# Altium schematic sheet mcu.SchDoc
size A4; SheetNumber: 2; SheetTotal: 3
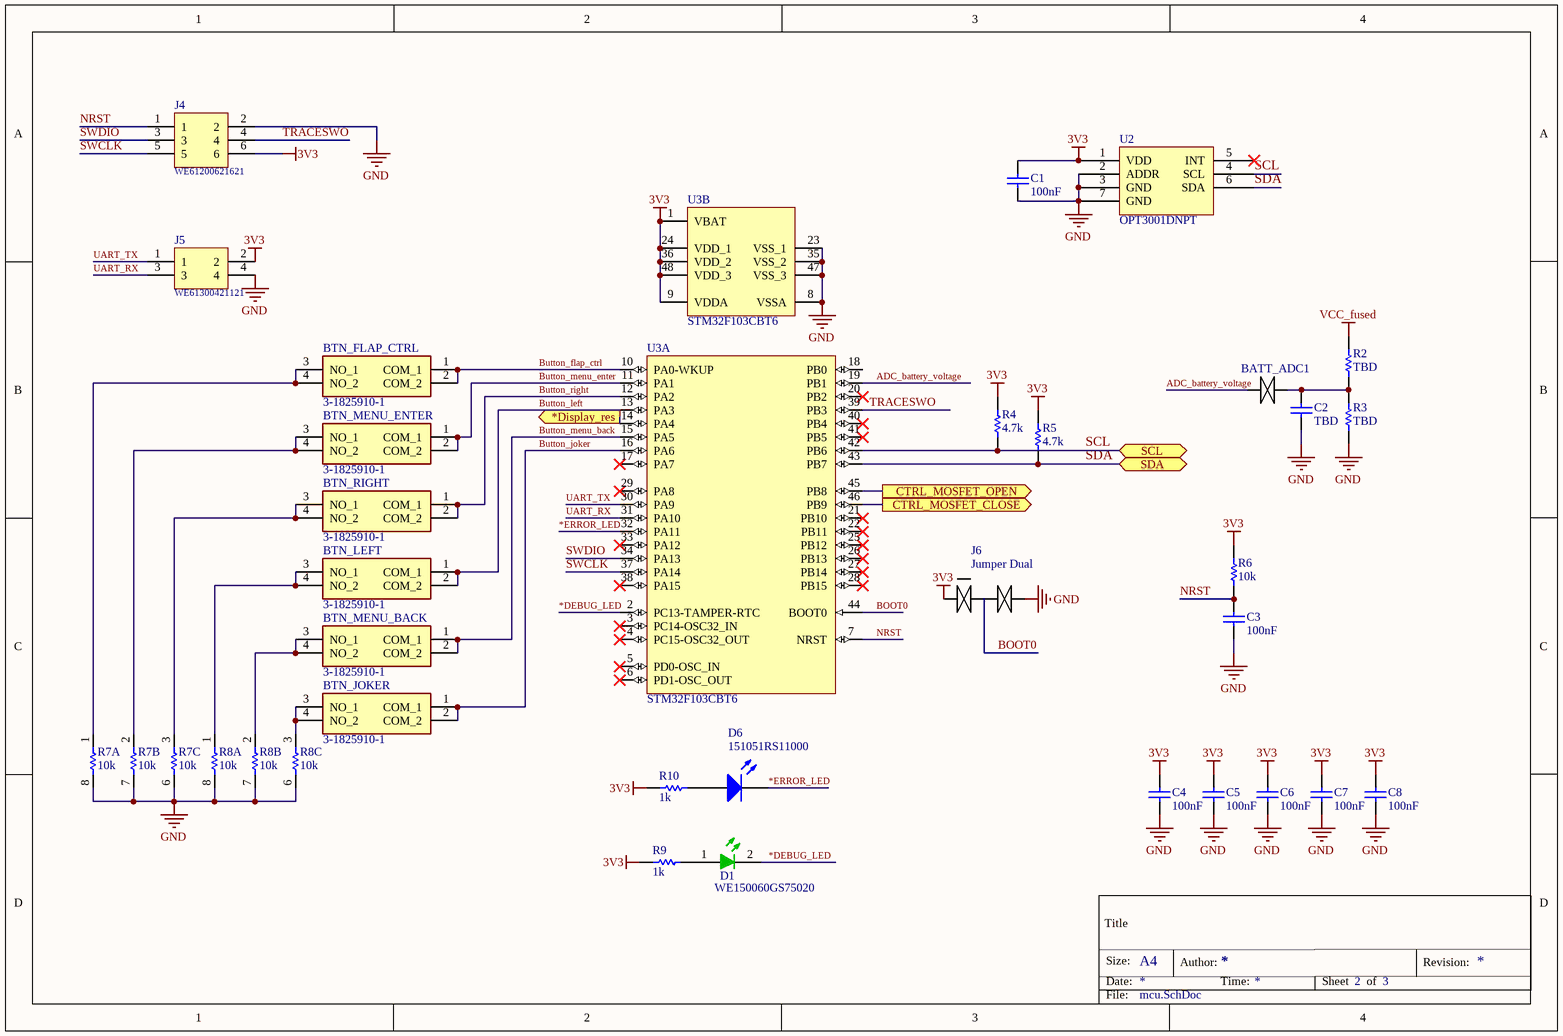
[diagram p0: mcu.SchDoc]

## Parts
BATT_ADC1  TIMER  [JUMPER_SINGLE_SMALL]  (value not drawn)
BTN_FLAP_CTRL  3-1825910-1  [318259101]
BTN_JOKER  3-1825910-1  [318259101]
BTN_LEFT  3-1825910-1  [318259101]
BTN_MENU_BACK  3-1825910-1  [318259101]
BTN_MENU_ENTER  3-1825910-1  [318259101]
BTN_RIGHT  3-1825910-1  [318259101]
C1  100nF  [CAP0603]
C2  TBD  [CAP0603]
C3  100nF  [CAP0603]
C4  100nF  [CAP0603]
C5  100nF  [CAP0603]
C6  100nF  [CAP0603]
C7  100nF  [CAP0603]
C8  100nF  [CAP0603]
D1  WE150060GS75020  [0603 LED Green]
D6  151051RS11000  [Type 5mm]
J4  WE61200621621  [WE61200621621]
J5  WE61300421121  [WE61300421121]
J6  Jumper Dual  [Jumper Dual]
R2  TBD  [RES0603]
R3  TBD  [RES0603]
R4  4.7k  [RES0603]
R5  4.7k  [RES0603]
R6  10k  [RES0603]
R7  value 10k  [BOUR-CAT16-103J4LF_M]  (hidden comment: CAT16-103J4LF)  (parts A,B,C of 4)
R8  value 10k  [BOUR-CAT16-103J4LF_M]  (hidden comment: CAT16-103J4LF)  (parts A,B,C of 4)
R9  1k  [RES0603]
R10  1k  [RES0603]
U2  OPT3001DNPT  [OPT3001DNPT]
U3  STM32F103CBT6  [STM-LQFP48_M]  (parts A,B of 2)

## Ports
*Display_res (out), CTRL_MOSFET_CLOSE (out), CTRL_MOSFET_OPEN (out), SCL (bidir), SDA (bidir)

## Nets
3V3: C1.2 C4.2 C5.2 C6.2 C7.2 C8.2 J4.6 J5.2 J6.1(A) R4.2 R5.2 R6.2 R9.2 R10.2 U2.1(VDD) U3.1(VBAT) U3.9(VDDA) U3.24(VDD_1) U3.36(VDD_2) U3.48(VDD_3)
GND: C1.1 C2.1 C3.1 C4.1 C5.1 C6.1 C7.1 C8.1 J4.2 J5.4 J6.2(B) R3.1 R7.6 R7.7 R7.8 R8.6 R8.7 R8.8 U2.2(ADDR) U2.3(GND) U2.7(GND) U3.8(VSSA) U3.23(VSS_1) U3.35(VSS_2) U3.47(VSS_3)
VCC_fused: R2.2
*DEBUG_LED: D1.2(K) U3.2(PC13-TAMPER-RTC)
*Display_res: U3.14(PA4) ; port *Display_res
*ERROR_LED: D6.1(K) U3.32(PA11)
ADC_battery_voltage: BATT_ADC1.2(B) U3.19(PB1)
BOOT0: J6.3(C) U3.44(BOOT0)
Button_flap_ctrl: BTN_FLAP_CTRL.1(COM_1) BTN_FLAP_CTRL.2(COM_2) U3.10(PA0-WKUP)
Button_joker: BTN_JOKER.1(COM_1) BTN_JOKER.2(COM_2) U3.16(PA6)
Button_left: BTN_LEFT.1(COM_1) BTN_LEFT.2(COM_2) U3.13(PA3)
Button_menu_back: BTN_MENU_BACK.1(COM_1) BTN_MENU_BACK.2(COM_2) U3.15(PA5)
Button_menu_enter: BTN_MENU_ENTER.1(COM_1) BTN_MENU_ENTER.2(COM_2) U3.11(PA1)
Button_right: BTN_RIGHT.1(COM_1) BTN_RIGHT.2(COM_2) U3.12(PA2)
CTRL_MOSFET_CLOSE: U3.46(PB9) ; port CTRL_MOSFET_CLOSE
CTRL_MOSFET_OPEN: U3.45(PB8) ; port CTRL_MOSFET_OPEN
NRST: C3.2 J4.1 R6.1 U3.7(NRST)
SCL: R4.1 U2.4(SCL) U3.42(PB6) ; port SCL
SDA: R5.1 U2.6(SDA) U3.43(PB7) ; port SDA
SWCLK: J4.5 U3.37(PA14)
SWDIO: J4.3 U3.34(PA13)
TRACESWO: J4.4 U3.39(PB3)
UART_RX: J5.3 U3.31(PA10)
UART_TX: J5.1 U3.30(PA9)
NetBATT_ADC1_1: BATT_ADC1.1(A) C2.2 R2.1 R3.2
NetBTN_FLAP_CTRL_3: BTN_FLAP_CTRL.3(NO_1) BTN_FLAP_CTRL.4(NO_2) R7.1
NetBTN_JOKER_3: BTN_JOKER.3(NO_1) BTN_JOKER.4(NO_2) R8.3
NetBTN_LEFT_3: BTN_LEFT.3(NO_1) BTN_LEFT.4(NO_2) R8.1
NetBTN_MENU_BACK_3: BTN_MENU_BACK.3(NO_1) BTN_MENU_BACK.4(NO_2) R8.2
NetBTN_MENU_ENTER_3: BTN_MENU_ENTER.3(NO_1) BTN_MENU_ENTER.4(NO_2) R7.2
NetBTN_RIGHT_3: BTN_RIGHT.3(NO_1) BTN_RIGHT.4(NO_2) R7.3
NetD1_1: D1.1(A) R9.1
NetD6_2: D6.2(A) R10.1

Not connected (* = marked no-connect by the designer): U2 5(INT)*; U3 3(PC14-OSC32_IN)* 4(PC15-OSC32_OUT)* 5(PD0-OSC_IN)* 6(PD1-OSC_OUT)* 17(PA7)* 18(PB0) 20(PB2)* 21(PB10)* 22(PB11)* 25(PB12)* 26(PB13)* 27(PB14)* 28(PB15)* 29(PA8)* 33(PA12)* 38(PA15)* 40(PB4)* 41(PB5)*

## Notes on the sheet
- Title
- Size:
- Date:
- A4
- Author:
- Time:
- Sheet
- of
- Revision:
- File:

## Library data of the parts
BATT_ADC1 = JUMPER_SINGLE: 2 pads which can be connected truth soldering
BTN_FLAP_CTRL BTN_JOKER BTN_LEFT BTN_MENU_BACK BTN_MENU_ENTER BTN_RIGHT = 3-1825910-1: Switch; Manufacturer_Name: TE Connectivity; Datasheet Link: https://www.te.com/commerce/DocumentDelivery/DDEController?Action=srchrtrv&DocNm=1825910&DocType=Customer+Drawing&DocLang=English; Height: 17mm; Manufacturer_Part_Number: 3-1825910-1; Arrow Part Number: 3-1825910-1; Arrow Price/Stock: https://www.arrow.com/en/products/3-1825910-1/te-connectivity?region=nac
C1-C8 = Capacitor 0603: Chip Capacitor 0603, Body 1.6x0.8mm, IPC Medium Density
  C1 C3-C8: Value: 100nF
  C2: Value: TBD
D1 = LED Green 0603: LED, SMT, 0603(1608), 1.1mm thickness, Green
D6 = CMP-1488-00008-1: THT LED round mono-color color lens, WL-TMRW, Red; Manufacturer: Wuerth Elektronik; PackageReference: Type 5mm; PartNumber: 151051RS11000; ComponentLink2URL: http://katalog.we-online.de/pbs/datasheet/7448042001.pdfhttp://katalog.we-online.de/pbs/datasheet/7448042001.pdfhttp://katalog.we-online.de/pbs/datasheet/7448042001.pdfhttp://katalog.we-online.de/pbs/datasheet/151051RS11000.pdf; ComponentLink1URL: http://www.we-online.com; ComponentLink1Description: Manufacturer URL; ComponentLink2Description: Datasheet; Emitting color: Red
J4 = WE61200621621: WR-PHD Box Header, THT, pitch 2.54mm, Dual Row, Vertical, 6pin; Part Number: 61300621121; Pin Number: 6; Gender: Male; Rated Current: 3A; Working Voltage: 250VAC; Withstanding Voltage: 500VAC; Contact Resistance: 20mOhm; ComponentLink1Description: Manufacturer; ComponentLink1URL: http://www.we-online.de; ComponentLink2Description: Datasheet; ComponentLink2URL: https://katalog.we-online.de/em/datasheet/6130xx21121.pdf; Published Date: June 2019; Publisher: Wurth Elektronik; Pitch: 2.54mm; Operating Temperature: -40 to +105degC; Mounting Technology: THT; Packaging: Bag; Row Number: Dual; Orientation: Vertical
J5 = WE61300421121: WR-PHD Pin Header, THT, pitch 2.54mm, Dual Row, Vertical, 4pin; Pin Number: 4; Gender: Male; Rated Current: 3A; Working Voltage: 250VAC; Withstanding Voltage: 500VAC; Contact Resistance: 20mOhm; ComponentLink1Description: Manufacturer; ComponentLink1URL: http://www.we-online.de; ComponentLink2Description: Datasheet; ComponentLink2URL: https://katalog.we-online.de/em/datasheet/6130xx21121.pdf; Part Number: 61300421121; Published Date: June 2019; Publisher: Wurth Elektronik; Pitch: 2.54mm; Operating Temperature: -40 to +105degC; Mounting Technology: THT; Packaging: Bag; Row Number: Dual; Orientation: Vertical
R2-R5 R9 R10 = Resistor 0603: Chip Resistor 0603, Body 1.6x0.8mm, IPC Medium Density
  R2 R3: Value: TBD
  R4 R5: Value: 4.7k
  R9 R10: Value: 1k
R6 = Resistor 0603: Chip Resistor 0603, Body 1.0x0.5mm, IPC Medium Density; Value: 10k
R7 R8 = CAT16-103J4LF alternative: 10k Array in Alternative symbol
U2 = OPT3001DNPT: Sensoren für Umgebungslicht Ambient Light Sensor -USON -40 to 85
U3 = STM32F103CBT6: ARM Cortex-M3 32-bit MCU, 128 KB Flash, 20 KB Internal RAM, 37 I/Os, 48-pin LQFP, -40 to 85 degC, Tray; PartNumber: STM32F103C8T6; A/D Converter: 2x12-bit (10 Channel); FLASH Size (Prog) (kB): 64; I/Os (High Current): 37; Internal RAM Size (kB): 20; Operating Frequency(F) (Processor speed) (MHz): 72; Supply Voltage(Vcc) min (V): 2; DatasheetVersion: Rev. 16; PackageVersion: Rev. 6, 06/2013; PackageReference: LQFP48; PackageDescription: 48-Pin Low Profile Quad Flat Package, 7 x 7 mm Body, 0.5 mm Pitch; Core: ARM Cortex-M3; Packing: Tray; Mounting Technology: Surface Mount; ComponentLink1Description: Manufacturer URL; ComponentLink1URL: http://www.st.com/web/en/home.html; ComponentLink2Description: Datasheet; ComponentLink2URL: http://www.st.com/st-web-ui/static/active/en/resource/technical/document/datasheet/CD00161566.pdf; ComponentLink3Description: Package Specification; ComponentLink3URL: http://www.st.com/st-web-ui/static/active/en/resource/technical/document/datasheet/DM00058181.pdf